# Altium project Coffee_printer.PrjPcb (part 2 of 2)

## Sheet Drivers_TMC2209.SchDoc: Device
size 420 x 297 mm; SheetNumber: 4; SheetTotal: 5; ProjectTitle: Prj name
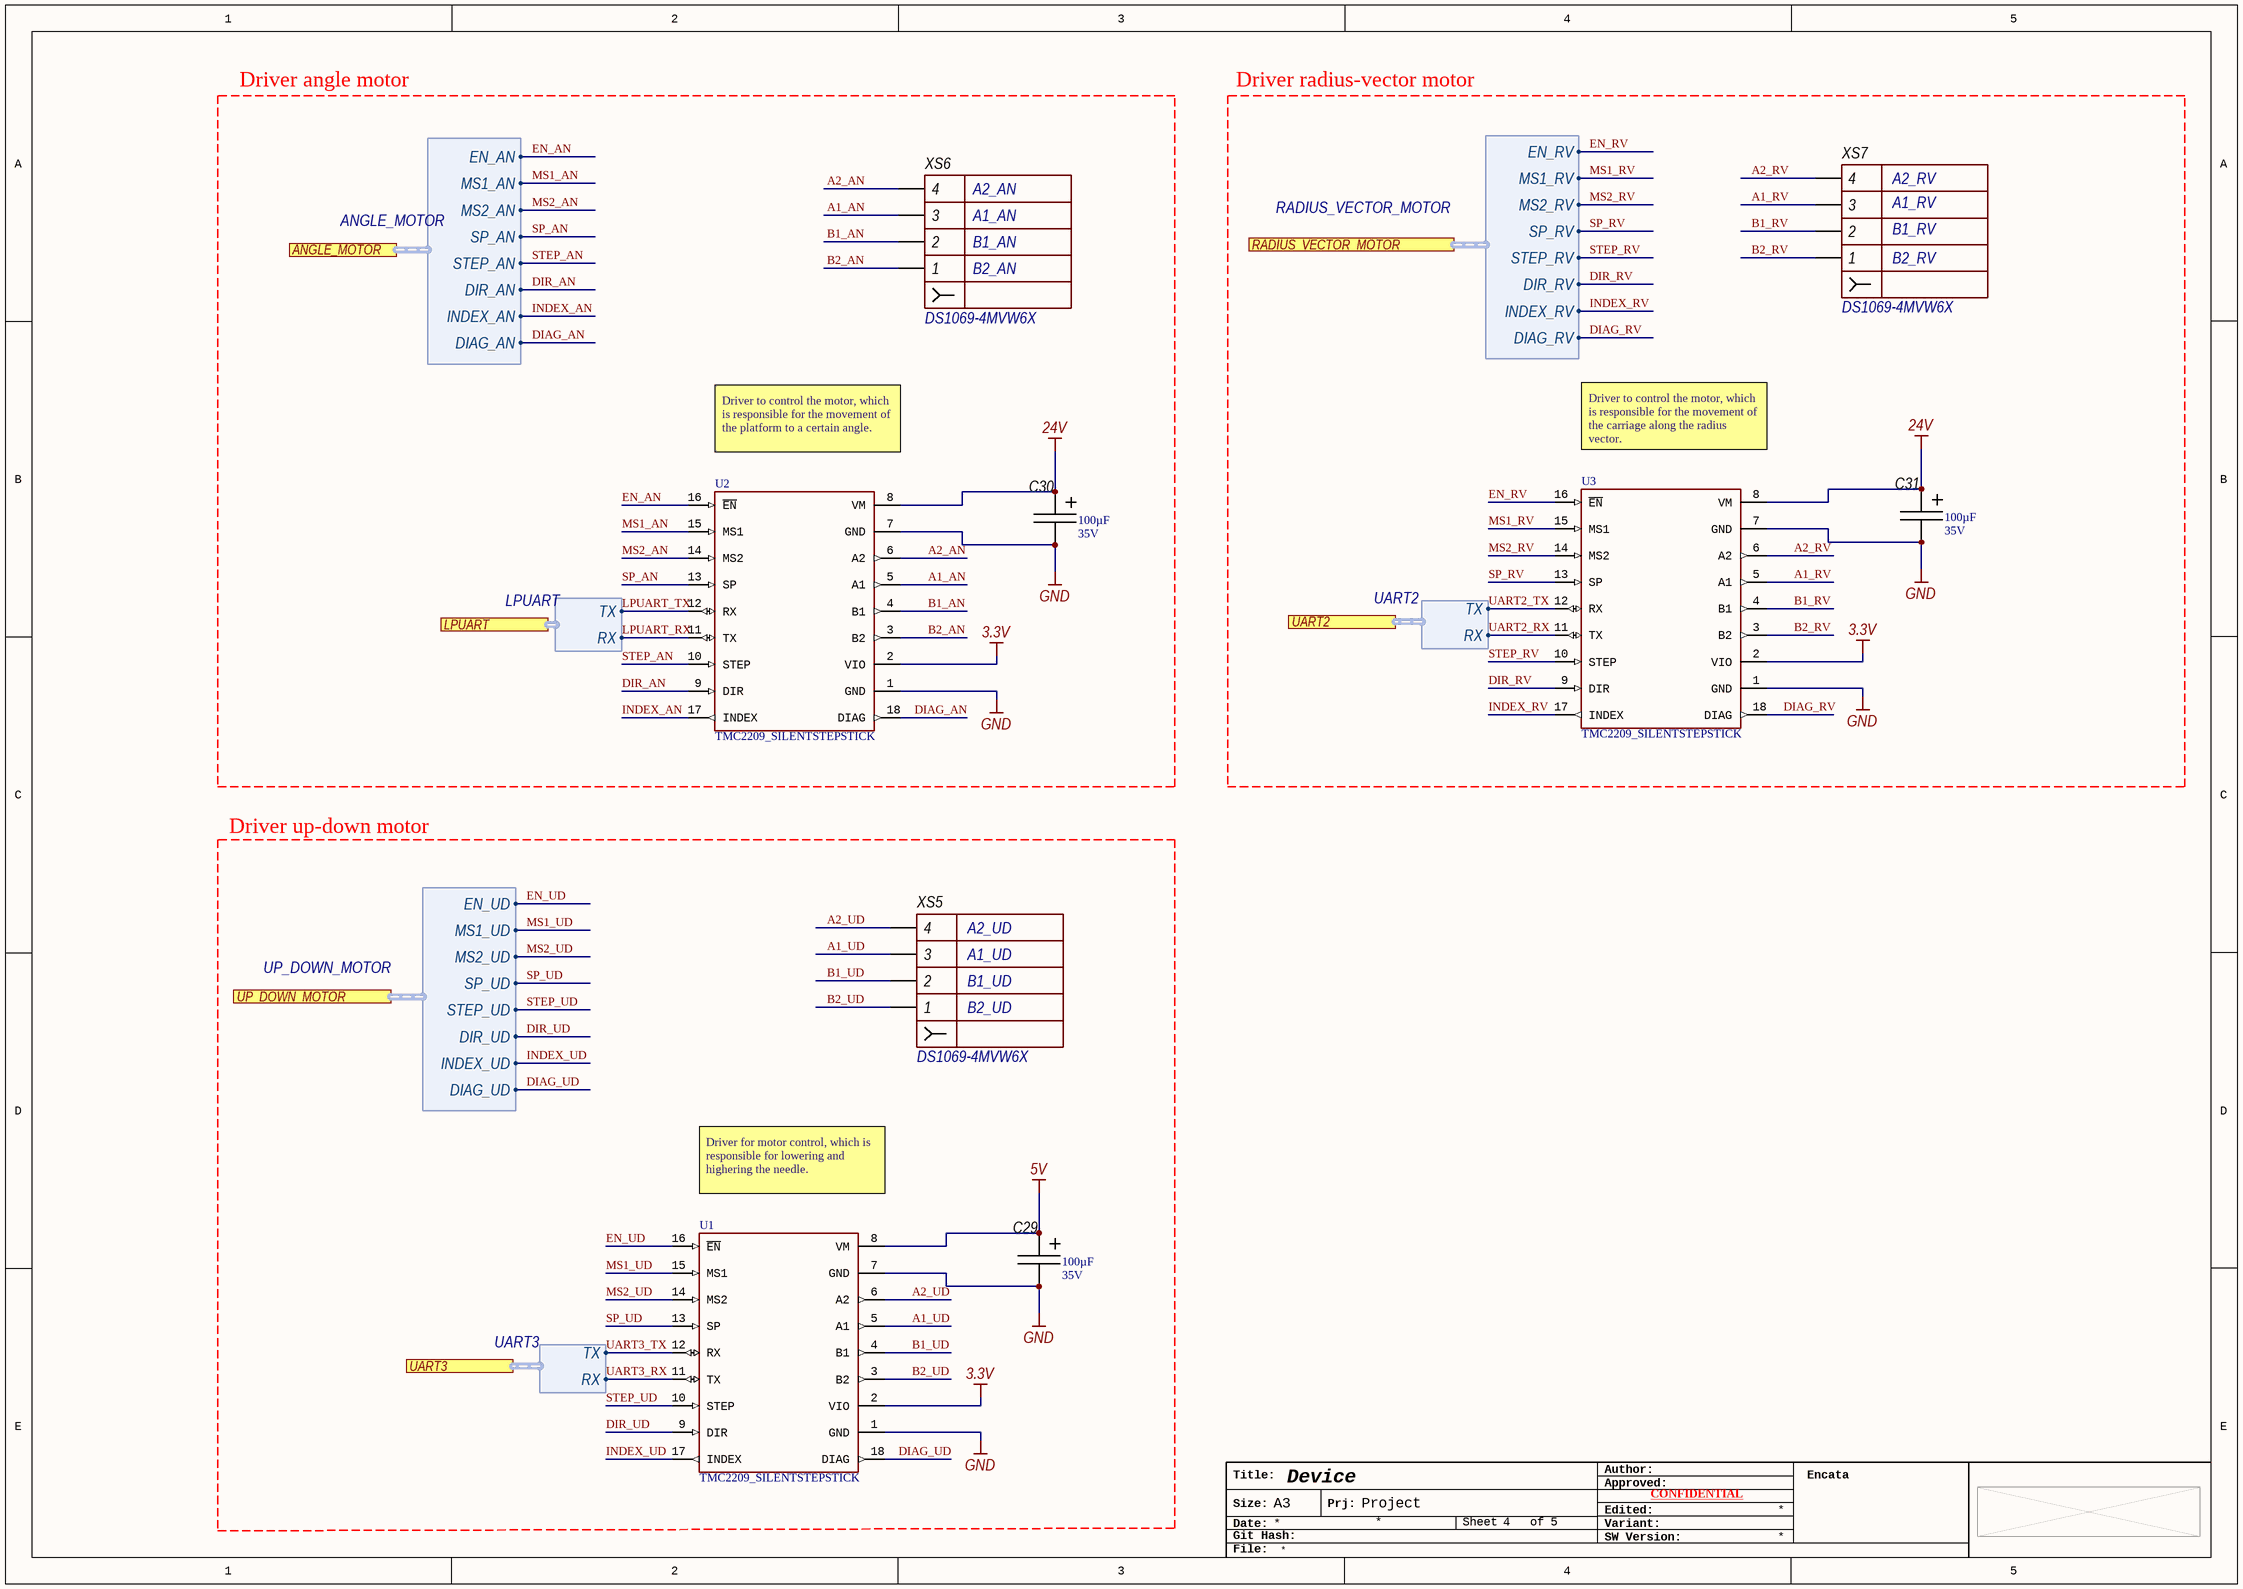
[diagram p3: Drivers_TMC2209.SchDoc]

### Parts
C29  Capacitance: 100µF  Voltage Rating: 35V  [CAPELSMD_D6.3_H7.7]  (hidden comment: EEEFK1V101XP)
C30  Capacitance: 100µF  Voltage Rating: 35V  [CAPELSMD_D6.3_H7.7]  (hidden comment: EEEFK1V101XP)
C31  Capacitance: 100µF  Voltage Rating: 35V  [CAPELSMD_D6.3_H7.7]  (hidden comment: EEEFK1V101XP)
U1  TMC2209_SILENTSTEPSTICK  [MODULE_TMC2209_SILENTSTEPSTICK]
U2  TMC2209_SILENTSTEPSTICK  [MODULE_TMC2209_SILENTSTEPSTICK]
U3  TMC2209_SILENTSTEPSTICK  [MODULE_TMC2209_SILENTSTEPSTICK]
XS5  DS1069-4MVW6X  NET4: A2_UD  NET3: A1_UD  NET2: B1_UD  NET1: B2_UD  [CWF-4]
XS6  DS1069-4MVW6X  NET4: A2_AN  NET3: A1_AN  NET2: B1_AN  NET1: B2_AN  [CWF-4]
XS7  DS1069-4MVW6X  NET4: A2_RV  NET3: A1_RV  NET2: B1_RV  NET1: B2_RV  [CWF-4]

### Blocks framed on the sheet
Driver angle motor: C30 U2 XS6
Driver radius-vector motor: C31 U3 XS7
Driver up-down motor: C29 U1 XS5

### Ports
ANGLE_MOTOR (harness ANGLE_MOTOR), LPUART (harness LPUART), RADIUS_VECTOR_MOTOR (harness RADIUS_VECTOR_MOTOR), UART2 (harness UART2), UART3 (harness UART3), UP_DOWN_MOTOR (harness UP_DOWN_MOTOR)

### Harnesses
UART2: RX, TX
UART3: RX, TX
ANGLE_MOTOR: MS1_AN, EN_AN, MS2_AN, SP_AN, STEP_AN, DIR_AN, INDEX_AN, DIAG_AN
RADIUS_VECTOR_MOTOR: MS1_RV, EN_RV, MS2_RV, SP_RV, STEP_RV, DIR_RV, INDEX_RV, DIAG_RV
UP_DOWN_MOTOR: MS1_UD, EN_UD, MS2_UD, SP_UD, STEP_UD, DIR_UD, INDEX_UD, DIAG_UD
LPUART: RX, TX

### Nets
3.3V: U1.2(VIO) U2.2(VIO) U3.2(VIO)
5V: C29.1 U1.8(VM)
24V: C30.1 C31.1 U2.8(VM) U3.8(VM)
GND: C29.2 C30.2 C31.2 U1.1(GND) U1.7(GND) U2.1(GND) U2.7(GND) U3.1(GND) U3.7(GND)
A1_AN: U2.5(A1) XS6.3
A1_RV: U3.5(A1) XS7.3
A1_UD: U1.5(A1) XS5.3
A2_AN: U2.6(A2) XS6.4
A2_RV: U3.6(A2) XS7.4
A2_UD: U1.6(A2) XS5.4
B1_AN: U2.4(B1) XS6.2
B1_RV: U3.4(B1) XS7.2
B1_UD: U1.4(B1) XS5.2
B2_AN: U2.3(B2) XS6.1
B2_RV: U3.3(B2) XS7.1
B2_UD: U1.3(B2) XS5.1
DIAG_AN: U2.18(DIAG) ; port ANGLE_MOTOR.DIAG_AN
DIAG_RV: U3.18(DIAG) ; port RADIUS_VECTOR_MOTOR.DIAG_RV
DIAG_UD: U1.18(DIAG) ; port UP_DOWN_MOTOR.DIAG_UD
DIR_AN: U2.9(DIR) ; port ANGLE_MOTOR.DIR_AN
DIR_RV: U3.9(DIR) ; port RADIUS_VECTOR_MOTOR.DIR_RV
DIR_UD: U1.9(DIR) ; port UP_DOWN_MOTOR.DIR_UD
EN_AN: U2.16(~{EN}) ; port ANGLE_MOTOR.EN_AN
EN_RV: U3.16(~{EN}) ; port RADIUS_VECTOR_MOTOR.EN_RV
EN_UD: U1.16(~{EN}) ; port UP_DOWN_MOTOR.EN_UD
INDEX_AN: U2.17(INDEX) ; port ANGLE_MOTOR.INDEX_AN
INDEX_RV: U3.17(INDEX) ; port RADIUS_VECTOR_MOTOR.INDEX_RV
INDEX_UD: U1.17(INDEX) ; port UP_DOWN_MOTOR.INDEX_UD
LPUART_RX: U2.11(TX) ; port LPUART.RX
LPUART_TX: U2.12(RX) ; port LPUART.TX
MS1_AN: U2.15(MS1) ; port ANGLE_MOTOR.MS1_AN
MS1_RV: U3.15(MS1) ; port RADIUS_VECTOR_MOTOR.MS1_RV
MS1_UD: U1.15(MS1) ; port UP_DOWN_MOTOR.MS1_UD
MS2_AN: U2.14(MS2) ; port ANGLE_MOTOR.MS2_AN
MS2_RV: U3.14(MS2) ; port RADIUS_VECTOR_MOTOR.MS2_RV
MS2_UD: U1.14(MS2) ; port UP_DOWN_MOTOR.MS2_UD
SP_AN: U2.13(SP) ; port ANGLE_MOTOR.SP_AN
SP_RV: U3.13(SP) ; port RADIUS_VECTOR_MOTOR.SP_RV
SP_UD: U1.13(SP) ; port UP_DOWN_MOTOR.SP_UD
STEP_AN: U2.10(STEP) ; port ANGLE_MOTOR.STEP_AN
STEP_RV: U3.10(STEP) ; port RADIUS_VECTOR_MOTOR.STEP_RV
STEP_UD: U1.10(STEP) ; port UP_DOWN_MOTOR.STEP_UD
UART2_RX: U3.11(TX) ; port UART2.RX
UART2_TX: U3.12(RX) ; port UART2.TX
UART3_RX: U1.11(TX) ; port UART3.RX
UART3_TX: U1.12(RX) ; port UART3.TX

### Notes on the sheet
- (near U2) Driver to control the motor, which is responsible for the movement of the platform to a certain angle.
- (near U3) Driver to control the motor, which is responsible for the movement of the carriage along the radius vector.
- (near U1) Driver for motor control, which is responsible for lowering and highering the needle.
- Title:
- Author:
- Approved:
- Size:
- Date:
- Git Hash:
- A3
- Prj:
- Sheet
- of
- SW Version:
- Variant:
- Edited:
- CONFIDENTIAL
- File:

### Library data of the parts
C29-C31 = CMP-CAP-EL-SMD-0045-2: 35V 100uF 105°C (6,3x7,7mm )2000Hours; Manufacturer: Panasonic; Dissipation Factor: 12%; ESR (Equivalent Series Resistance): 0.34; Leakage Current: 3µA; Ripple Current: 280mA; Tolerance: 20%; Author: M.S.Koval; Case/Package: Radial; Diameter: 6.3mm; Height: 7.7mm; HelpURL: https://b2b-api.panasonic.eu/file_stream/pids/fileversion/3127; Lead Free: Lead Free; Length: 7.7mm; Life (Hours): 2000Hour; Manufacturer Part Number: EEEFK1V101XP; Max Operating Temperature: 105°C; Min Operating Temperature: -55°C; Series: FK
U1-U3 = TMC2209_SILENTSTEPSTICK: TMC2209 Motor Controller/Driver Power Management Evaluation Board; MP: TMC2209 SILENTSTEPSTICK; MF: Trinamic Motion Control GmbH; Check_prices: https://www.snapeda.com/parts/TMC2209%20SILENTSTEPSTICK/Trinamic+Motion+Control+GmbH/view-part/?ref=eda; Price: None; SnapEDA_Link: https://www.snapeda.com/parts/TMC2209%20SILENTSTEPSTICK/Trinamic+Motion+Control+GmbH/view-part/?ref=snap; Availability: In Stock; Value: *; Purchase-URL: https://pricing.snapeda.com/search/part/TMC2209 SILENTSTEPSTICK/?ref=eda; Package: None
XS5-XS7 = CMP-CON-B2B-0011-2: 2.5mm, 4 pin, Male, 3A, Vertical mounting, CONNFLY; Gender: Female; Number of Contacts: 4; Voltage Rating: 250V; Author: a.antipov; Color: White; Contact Current Rating: 3A; Contact Gender: Male; Contact Plating: Tin; HelpURL: http://outer.connfly.group/static/upload/file/pdf/DS1069.pdf; Manufacturer: CONNFLY; Manufacturer Part Number: DS1069-4MVW6X; Mount: Through Hole; Orientation: Vertical; Pitch: 2.5mm

## Sheet Pump.SchDoc: Device
size 420 x 297 mm; SheetNumber: 5; SheetTotal: 5; ProjectTitle: Prj name
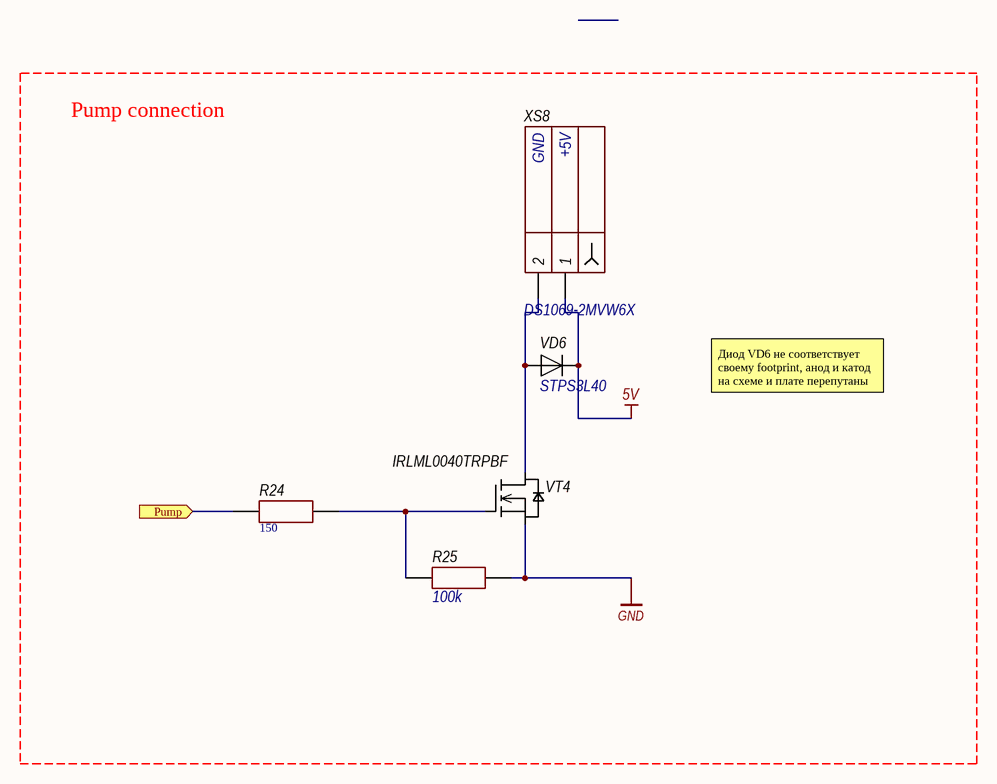
[diagram p4: Pump.SchDoc]

### Parts
R24  Resistance: 150  [RESC0603_N]  (hidden comment: RC0603FR-07150RL)
R25  Resistance: 100k  [RESC0603_N]  (hidden comment: RC0603FR-07100KL)
VD6  STPS3L40  [STPS3L40]
VT4  IRLML0040TRPBF  [SOT-23-3]
XS8  DS1069-2MVW6X  NET2: GND  NET1: +5V  [CWF-2]

### Blocks framed on the sheet
Pump connection: R24 R25 VD6 VT4 XS8

### Ports
Pump (in)

### Nets
5V: VD6.2 XS8.1
GND: R25.1 VT4.2(S)
NetDD1_2: R24.1 ; port Pump
NetR24_2: R24.2 R25.2 VT4.1(G)
NetVD6_1: VD6.1 VT4.3(D) XS8.2

### Notes on the sheet
- Диод VD6 не соответствует своему footprint, анод и катод на схеме и плате перепутаны
- Title:
- Author:
- Approved:
- Size:
- Date:
- Git Hash:
- A3
- Prj:
- Sheet
- of
- SW Version:
- Variant:
- Edited:
- CONFIDENTIAL
- File:

### Library data of the parts
R24 = CMP-RES-SMD-0393-5: RES SMD 150 OHM 1% 1/10W 0603; Manufacturer: Yageo; Max Power Dissipation: 100mW; Temperature Coefficient: ±100ppm/C°; Voltage Rating: 75V; Author: M.S. Koval; Case/Package: 0603; HelpURL: https://www.yageo.com/upload/media/product/productsearch/datasheet/rchip/PYu-RC_Group_51_RoHS_L_11.pdf; Manufacturer Part Number: RC0603FR-07150RL; Max Operating Temperature: 155°C; Min Operating Temperature: -55°C; Tolerance: 1%
R25 = CMP-RES-SMD-0462-2: RES SMD 100 KOHM 1% 1/10W 0603; Manufacturer: Yageo; Max Power Dissipation: 100mW; Temperature Coefficient: ±100ppm/C°; Voltage Rating: 75V; Author: M.S. Koval; Case/Package: 0603; HelpURL: https://www.yageo.com/upload/media/product/productsearch/datasheet/rchip/PYu-RC_Group_51_RoHS_L_11.pdf; Manufacturer Part Number: RC0603FR-07100KL; Max Operating Temperature: 155°C; Min Operating Temperature: -55°C; Tolerance: 1%
VD6 = CMP-DISCRETE-DIODES0017-2: Rectifier Diode, Schottky, 1 Phase, 1 Element, 3A, 40V V(RRM), Silicon, DO-214AB; pin to pad: 1>2 2>1; Manufacturer: ST; Forward Voltage: 400mV; Peak Non-Repetitive Surge Current: 75A; Author: v.taranov; Average Rectified Current: 3A; Case/Package: SMC; Forward Current: 3A; HelpUrl: https://www.st.com/resource/en/datasheet/stps3l40.pdf; Manufacturer Part Number: STPS3L40; Max Operating Temperature: 150°C; Min Operating Temperature: -65°C; Mount: Surface Mount; Number of Pins: 2
VT4 = CMP-DISCRETE-TRANSISTORS-MOSFET0018-2: 40V 3.6A 56mΩ@10V,3.6A 1.3W N Channel SOT-23 MOSFETs ROHS; Manufacturer: Infineon Technologies; Input Capacitance: 266pF; Rds ON Max: 78m; Theshold Voltage Vgth: 1.8V; Type: N-ch; Author: m.boltromeyuk; Continuous Drain Current ID: 3.6A; Drain to Source Voltage Vds: 40V; HelpUrl: https://www.infineon.com/dgdl/Infineon-IRLML0040-DataSheet-v01_01-EN.pdf?fileId=5546d462533600a401535664894825e4; Manufacturer Part Number: IRLML0040TRPbF; Mount: Surface mount; Power Dissipation: 1.3W
XS8 = CMP-CON-B2B-0007-3: 2.5mm, 2 pin, Male, 3A, Vertical mounting, CONNFLY; Gender: Female; Number of Contacts: 2; Voltage Rating: 250V; Author: a.antipov; Color: White; Contact Current Rating: 3A; Contact Gender: Male; Contact Plating: Tin; HelpURL: http://outer.connfly.group/static/upload/file/pdf/DS1069.pdf; Manufacturer: CONNFLY; Manufacturer Part Number: DS1069-2MVW6X; Mount: Through Hole; Orientation: Vertical; Pitch: 2.5mm

## Nets that join several sheets
3.3V: Coffee_printer MCU (26 pins), Coffee_printer PWR (5 pins), USB-UART (R21.1), Drivers_TMC2209 (U1.2 U2.2 U3.2)
5V: Coffee_printer PWR (8 pins), USB-UART (VD5.2), Drivers_TMC2209 (C29.1 U1.8), Pump (VD6.2 XS8.1)
24V: Coffee_printer PWR (6 pins), Drivers_TMC2209 (C30.1 C31.1 U2.8 U3.8)
GND: Coffee_printer MCU (31 pins), Coffee_printer PWR (16 pins), USB-UART (12 pins), Drivers_TMC2209 (9 pins), Pump (R25.1 VT4.2)
DIAG_AN: Coffee_printer MCU (DD1.34), Drivers_TMC2209 (U2.18)
DIAG_RV: Coffee_printer MCU (DD1.50), Drivers_TMC2209 (U3.18)
DIAG_UD: Coffee_printer MCU (DD1.29), Drivers_TMC2209 (U1.18)
DIR_AN: Coffee_printer MCU (DD1.36), Drivers_TMC2209 (U2.9)
DIR_RV: Coffee_printer MCU (DD1.52), Drivers_TMC2209 (U3.9)
DIR_UD: Coffee_printer MCU (DD1.27), Drivers_TMC2209 (U1.9)
EN_AN: Coffee_printer MCU (DD1.41), Drivers_TMC2209 (U2.16)
EN_RV: Coffee_printer MCU (DD1.58), Drivers_TMC2209 (U3.16)
EN_UD: Coffee_printer MCU (DD1.20), Drivers_TMC2209 (U1.16)
INDEX_AN: Coffee_printer MCU (DD1.35), Drivers_TMC2209 (U2.17)
INDEX_RV: Coffee_printer MCU (DD1.51), Drivers_TMC2209 (U3.17)
INDEX_UD: Coffee_printer MCU (DD1.28), Drivers_TMC2209 (U1.17)
LPUART_RX: Coffee_printer MCU (DD1.8), Drivers_TMC2209 (U2.11)
LPUART_TX: Coffee_printer MCU (DD1.9), Drivers_TMC2209 (U2.12)
MS1_AN: Coffee_printer MCU (DD1.40), Drivers_TMC2209 (U2.15)
MS1_RV: Coffee_printer MCU (DD1.57), Drivers_TMC2209 (U3.15)
MS1_UD: Coffee_printer MCU (DD1.21), Drivers_TMC2209 (U1.15)
MS2_AN: Coffee_printer MCU (DD1.39), Drivers_TMC2209 (U2.14)
MS2_RV: Coffee_printer MCU (DD1.56), Drivers_TMC2209 (U3.14)
MS2_UD: Coffee_printer MCU (DD1.22), Drivers_TMC2209 (U1.14)
NetDD1_2: Coffee_printer MCU (DD1.2), Pump (R24.1)
SP_AN: Coffee_printer MCU (DD1.38), Drivers_TMC2209 (U2.13)
SP_RV: Coffee_printer MCU (DD1.54), Drivers_TMC2209 (U3.13)
SP_UD: Coffee_printer MCU (DD1.23), Drivers_TMC2209 (U1.13)
STEP_AN: Coffee_printer MCU (DD1.37), Drivers_TMC2209 (U2.10)
STEP_RV: Coffee_printer MCU (DD1.53), Drivers_TMC2209 (U3.10)
STEP_UD: Coffee_printer MCU (DD1.26), Drivers_TMC2209 (U1.10)
UART1_RX: Coffee_printer MCU (DD1.43), USB-UART (R23.2)
UART1_TX: Coffee_printer MCU (DD1.42), USB-UART (R22.2)
UART2_RX: Coffee_printer MCU (DD1.17), Drivers_TMC2209 (U3.11)
UART2_TX: Coffee_printer MCU (DD1.16), Drivers_TMC2209 (U3.12)
UART3_RX: Coffee_printer MCU (DD1.25), Drivers_TMC2209 (U1.11)
UART3_TX: Coffee_printer MCU (DD1.24), Drivers_TMC2209 (U1.12)